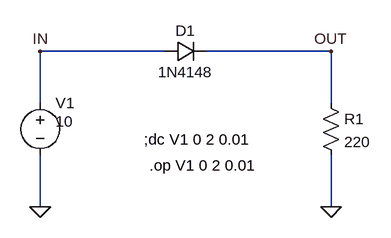
[diagram p0: schematic first.asc]
first.asc, the LTspice schematic file:
Version 4
SHEET 1 880 680
WIRE 400 0 208 0
WIRE 656 0 464 0
WIRE 208 80 208 0
WIRE 656 80 656 0
WIRE 208 240 208 160
WIRE 656 240 656 160
FLAG 208 240 0
FLAG 656 240 0
FLAG 208 0 IN
FLAG 656 0 OUT
DATAFLAG 656 224 "I(R1)"
DATAFLAG 544 0 ""
SYMBOL diode 400 16 R270
WINDOW 0 32 32 VTop 2
WINDOW 3 0 32 VBottom 2
SYMATTR InstName D1
SYMATTR Value 1N4148
SYMBOL res 640 64 R0
SYMATTR InstName R1
SYMATTR Value 220
SYMBOL voltage 208 64 R0
WINDOW 3 24 44 Left 2
WINDOW 123 0 0 Left 0
WINDOW 39 0 0 Left 0
SYMATTR Value 10
SYMATTR InstName V1
TEXT 368 136 Left 2 !;dc V1 0 2 0.01
TEXT 376 176 Left 2 !.op V1 0 2 0.01

The netlist it stands for:
* first.asc
D1 IN OUT 1N4148
R1 OUT 0 220
V1 IN 0 10
.model D D
.lib standard.dio
;dc V1 0 2 0.01
.op V1 0 2 0.01
.backanno
.end